# Altium project Battery_module.PrjPCB
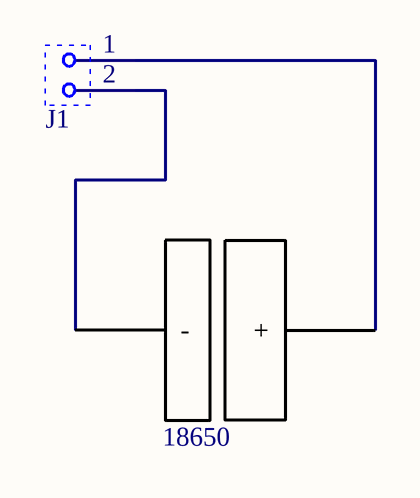
[diagram p0: battery_module.SchDoc]
1 sheet, 2 parts. Net scope: global (net labels, ports and power ports of the same name join across sheets).
Board file: battery_module.PcbDoc

## Sheet battery_module.SchDoc
size A4

### Parts
18650  18650_cell  [PCBComponent_1]  (value not drawn)
J1  Molex Microfit  [MICROFIT 1x2 Vertical]  (value not drawn)

### Nets
Net18650_0: 18650.0(-) J1.2
Net18650_1: 18650.1(+) J1.1

### Library data of the parts
18650 = 18650_cell: pin to pad: 0>1 1>2
J1 = Microfit 2x1: Symbol: Molex 430450212; Supplier: TME